# EAGLE design laser optocoupler rev00 (EAGLE 9.5.0)
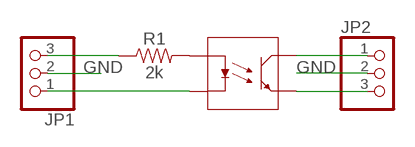
[diagram p0: schematic, sheet 1]

## Parts
JP1  PINHD-1X3  [1X03]
JP2  PINHD-1X3  [1X03]
R1  2k  1.8MOHM  [0603]
U$1  PS2701  [SOP_4PIN]

## Nets
GND: JP1.2 JP2.2
N$1: R1.2 U$1.1
N$2: JP1.3 R1.1
N$3: JP1.1 U$1.2
N$5: JP2.1 U$1.4
N$6: JP2.3 U$1.3

## Library data of the parts
JP1 JP2 = pinhead:PINHD-1X3: PIN HEADER
R1 = SparkFun-Resistors:1.8MOHM: 1.8 MOhms ±5% 0.1W, 1/10W Chip Resistor 0603; PROD_ID: RES-13994; VALUE: 1.8M
U$1 = gabriel:PS2701

## Board
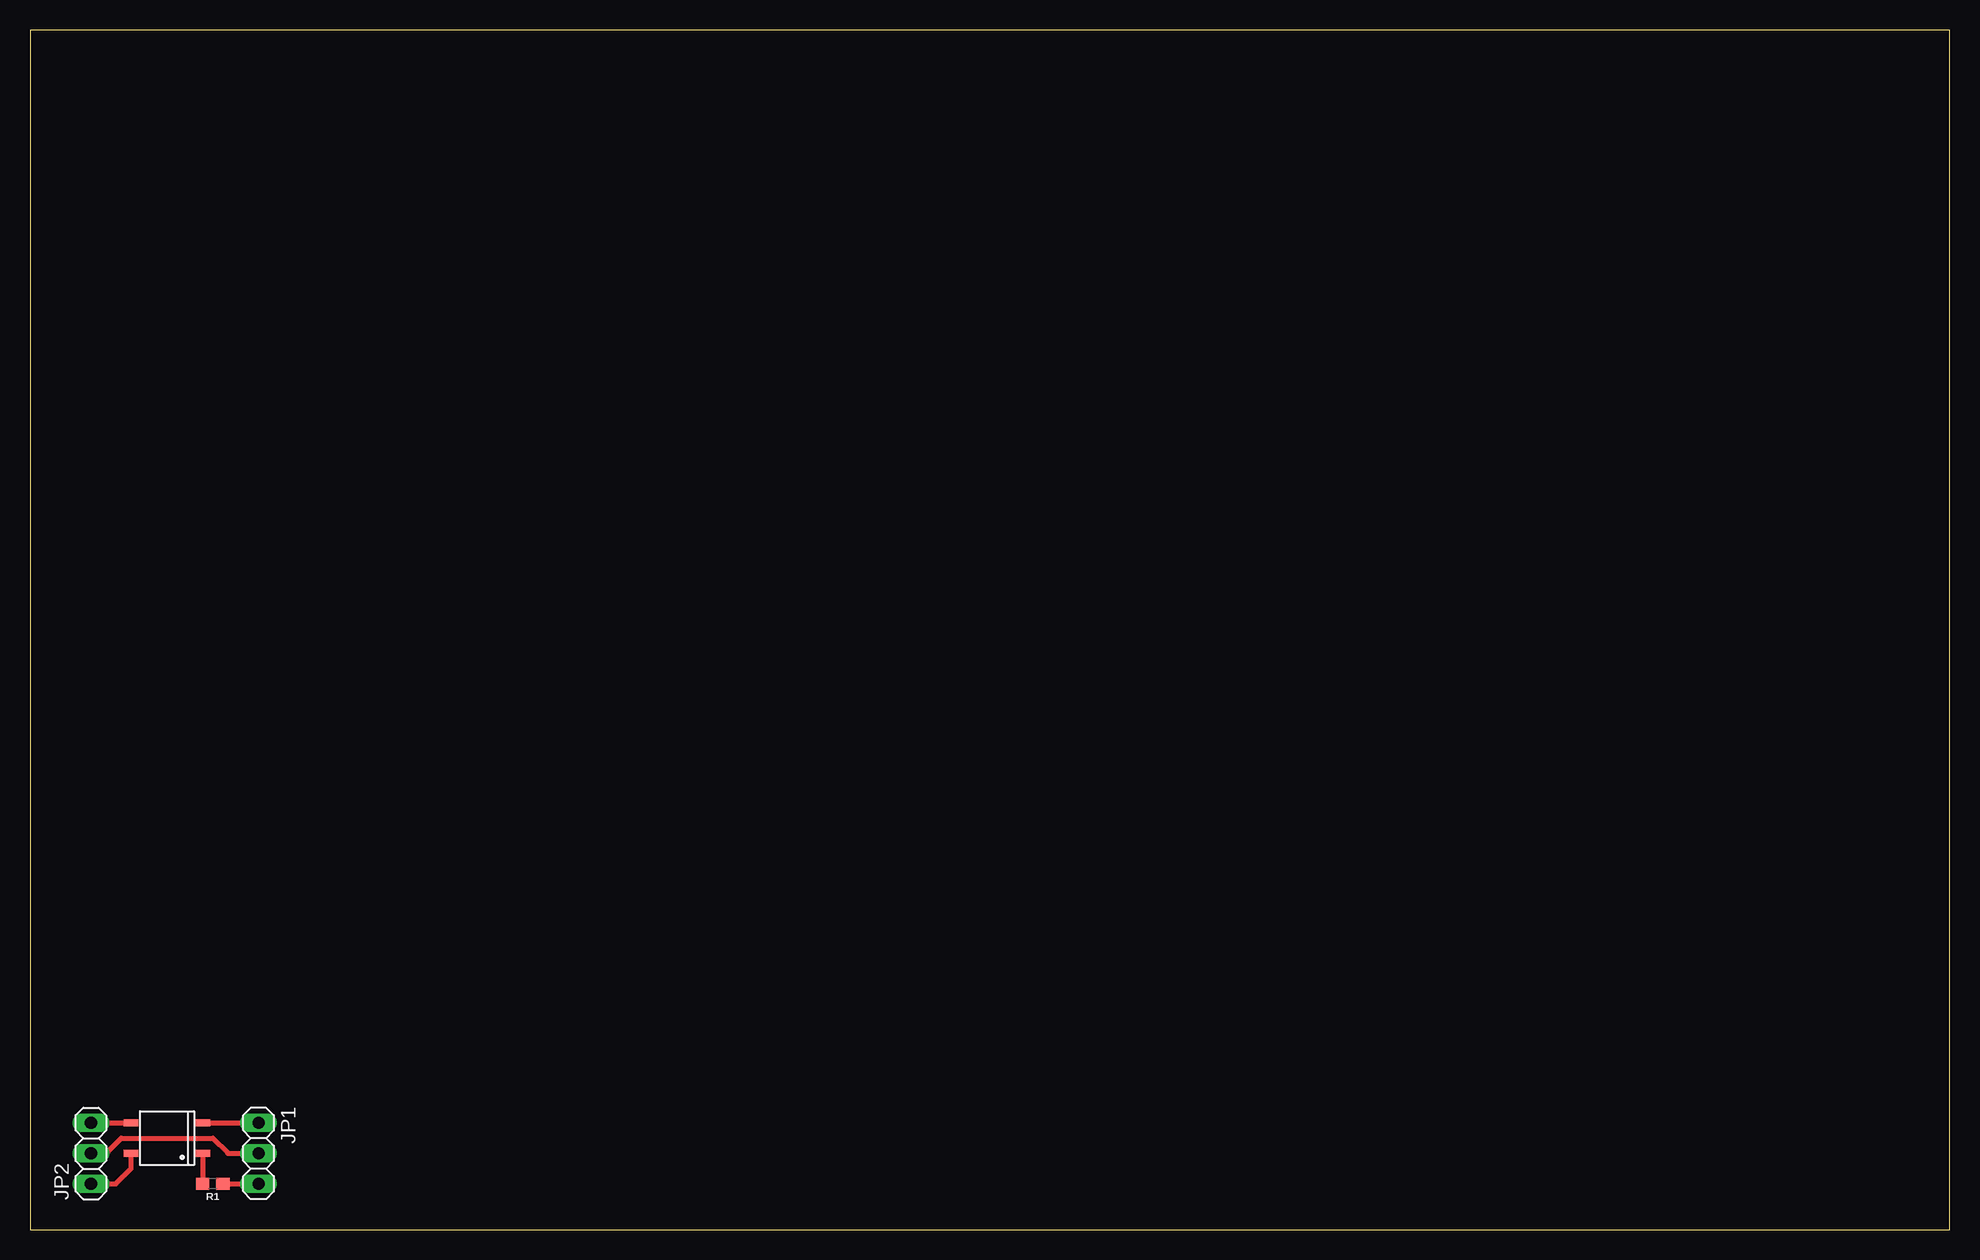
[diagram p1: board, top side]

Size 160 x 100 mm. Coordinates in mm from the lower left corner, seen from the top.
Outline: 0,0 160,0 160,100 0,100 0,0
Copper layers (1*16): Top 0.035mm / dielectric 1.5mm / Bottom 0.035mm
Design rules "default": minimum track width 6mil, minimum drill 0.35mm, track to track 6mil, track to pad 6mil, pad to pad 6mil, via to via 6mil, smd to smd 6mil, copper to edge 40mil, drill to drill 6mil, minimum pad ring 10mil, minimum via ring 8mil, stop-mask expansion 4mil, vias tented up to drill 0mil, thermal gap 10mil

### Footprints (pad centres in the part's own frame; a part is rotated, then mirrored left to right if it is on the bottom)
1X03 = drill 1.016 long: 1 -2.54,0; 2 0,0; 3 2.54,0
0603 = smd 1.1 x 1: 1 -0.85,0; 2 0.85,0
SOP_4PIN = smd 0.6 x 1.2: 1 -1.27,-3; 2 1.27,-3; 3 1.27,3; 4 -1.27,3

### Placement (x,y rotation side)
JP1  19.05,6.35 270 top
JP2  5.08,6.35 90 top
R1  15.24,3.81 180 top
U$1  11.43,7.62 90 top

### Tracks (layer width: path | path; a pad name or v marks a point on that pad's centre or on a via)
GND
  Top 0.406: JP2.2 6.35,6.35 7.62,7.62 15.24,7.62 16.51,6.35 JP1.2
N$1
  Top 0.406: U$1.1 14.39,6.31 R1.2
N$2
  Top 0.406: R1.1 JP1.3
N$3
  Top 0.406: U$1.2 JP1.1
N$5
  Top 0.406: JP2.1 7.16,3.81 8.43,5.08 U$1.4
N$6
  Top 0.406: JP2.3 U$1.3